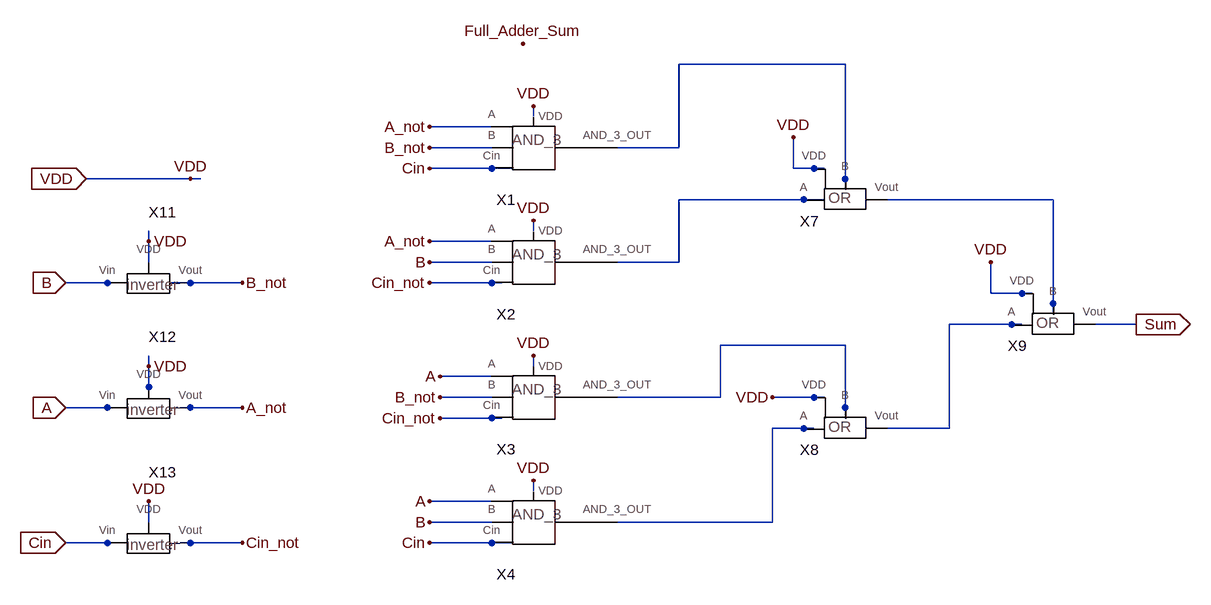
[diagram p0: schematic Fuller_Adder_Sum.asc]
Fuller_Adder_Sum.asc, the LTspice schematic file:
Version 4
SHEET 1 1184 936
WIRE 624 128 368 128
WIRE 144 208 144 192
WIRE 80 224 -16 224
WIRE 80 256 -16 256
WIRE 368 256 368 128
WIRE 368 256 272 256
WIRE 80 288 -16 288
WIRE 112 288 80 288
WIRE 544 288 544 240
WIRE 576 288 544 288
WIRE 592 288 576 288
WIRE -384 304 -544 304
WIRE -368 304 -384 304
WIRE 624 304 624 128
WIRE 624 320 624 304
WIRE 560 336 368 336
WIRE 592 336 560 336
WIRE 944 336 688 336
WIRE 144 384 144 368
WIRE -448 400 -448 384
WIRE 80 400 -16 400
WIRE -448 432 -448 400
WIRE 80 432 -16 432
WIRE 368 432 368 336
WIRE 368 432 272 432
WIRE -512 464 -576 464
WIRE -480 464 -512 464
WIRE -384 464 -416 464
WIRE -304 464 -384 464
WIRE 80 464 -16 464
WIRE 96 464 80 464
WIRE 848 480 848 432
WIRE 896 480 848 480
WIRE 912 480 896 480
WIRE 944 496 944 336
WIRE 944 512 944 496
WIRE 880 528 784 528
WIRE 896 528 880 528
WIRE 1072 528 1008 528
WIRE 624 560 432 560
WIRE -448 592 -448 576
WIRE 144 592 144 576
WIRE 80 608 0 608
WIRE -448 624 -448 592
WIRE -448 640 -448 624
WIRE 80 640 0 640
WIRE 432 640 432 560
WIRE 432 640 272 640
WIRE 576 640 512 640
WIRE 592 640 576 640
WIRE -512 656 -576 656
WIRE -480 656 -512 656
WIRE -384 656 -400 656
WIRE -304 656 -384 656
WIRE 624 656 624 560
WIRE 80 672 0 672
WIRE 96 672 80 672
WIRE 624 672 624 656
WIRE 560 688 512 688
WIRE 576 688 560 688
WIRE 784 688 784 528
WIRE 784 688 688 688
WIRE 144 784 144 768
WIRE 80 800 -16 800
WIRE -448 832 -448 800
WIRE 80 832 -16 832
WIRE 512 832 512 688
WIRE 512 832 272 832
WIRE -512 864 -576 864
WIRE -496 864 -512 864
WIRE -384 864 -400 864
WIRE -304 864 -384 864
WIRE 80 864 -16 864
WIRE 112 864 80 864
FLAG -576 464 B
IOPIN -576 464 In
FLAG -304 464 B_not
FLAG -576 656 A
IOPIN -576 656 In
FLAG -304 656 A_not
FLAG -16 224 A_not
FLAG -16 400 A_not
FLAG -16 256 B_not
FLAG 0 640 B_not
FLAG -16 800 A
FLAG 0 608 A
FLAG -16 288 Cin
FLAG -16 864 Cin
FLAG -16 432 B
FLAG -16 832 B
FLAG -16 464 Cin_not
FLAG 0 672 Cin_not
FLAG -576 864 Cin
IOPIN -576 864 In
FLAG -304 864 Cin_not
FLAG -544 304 VDD
IOPIN -544 304 In
FLAG -384 304 VDD
FLAG 512 640 VDD
FLAG 144 576 VDD
FLAG 144 368 VDD
FLAG 144 192 VDD
FLAG 144 768 VDD
FLAG 544 240 VDD
FLAG 848 432 VDD
FLAG 1072 528 Sum
IOPIN 1072 528 Out
FLAG 128 96 Full_Adder_Sum
FLAG -448 400 VDD
FLAG -448 592 VDD
FLAG -448 800 VDD
SYMBOL AND_3 176 256 R0
SYMATTR InstName X1
SYMBOL AND_3 176 432 R0
SYMATTR InstName X2
SYMBOL AND_3 176 640 R0
SYMATTR InstName X3
SYMBOL AND_3 176 832 R0
SYMATTR InstName X4
SYMBOL OR_gate 656 336 R0
SYMATTR InstName X7
SYMBOL OR_gate 656 688 R0
SYMATTR InstName X8
SYMBOL OR_gate 976 528 R0
SYMATTR InstName X9
SYMBOL Inverter -416 480 R0
SYMATTR InstName X11
SYMBOL Inverter -416 672 R0
SYMATTR InstName X12
SYMBOL Inverter -416 880 R0
SYMATTR InstName X13

The netlist it stands for:
* Fuller_Adder_Sum.asc
XX1 A_not B_not Cin VDD N001 AND_3  ; pins A B Cin VDD AND_3_OUT
XX2 A_not B Cin_not VDD N002 AND_3  ; pins A B Cin VDD AND_3_OUT
XX3 A B_not Cin_not VDD N005 AND_3  ; pins A B Cin VDD AND_3_OUT
XX4 A B Cin VDD N006 AND_3  ; pins A B Cin VDD AND_3_OUT
XX7 N002 N001 N003 VDD OR_gate  ; pins A B Vout VDD
XX8 N006 N005 N004 VDD OR_gate  ; pins A B Vout VDD
XX9 N004 N003 Sum VDD OR_gate  ; pins A B Vout VDD
XX11 B VDD B_not Inverter  ; pins Vin VDD Vout
XX12 A VDD A_not Inverter  ; pins Vin VDD Vout
XX13 Cin VDD Cin_not Inverter  ; pins Vin VDD Vout
.backanno
.end